# Altium schematic sheet main.SchDoc: Higgs Patch Antenna Array
size Letter; CompanyName: Signal Laboratories, Inc.; DrawnBy: J. Brinton; Engineer: J. Brinton; Address1: 3479 Edison Way; Address2: Menlo Park CA 94025; Address3: +1 (877) 778-8435; Address4: siglabs.com; Revision: 1; SheetNumber: 1; SheetTotal: 1
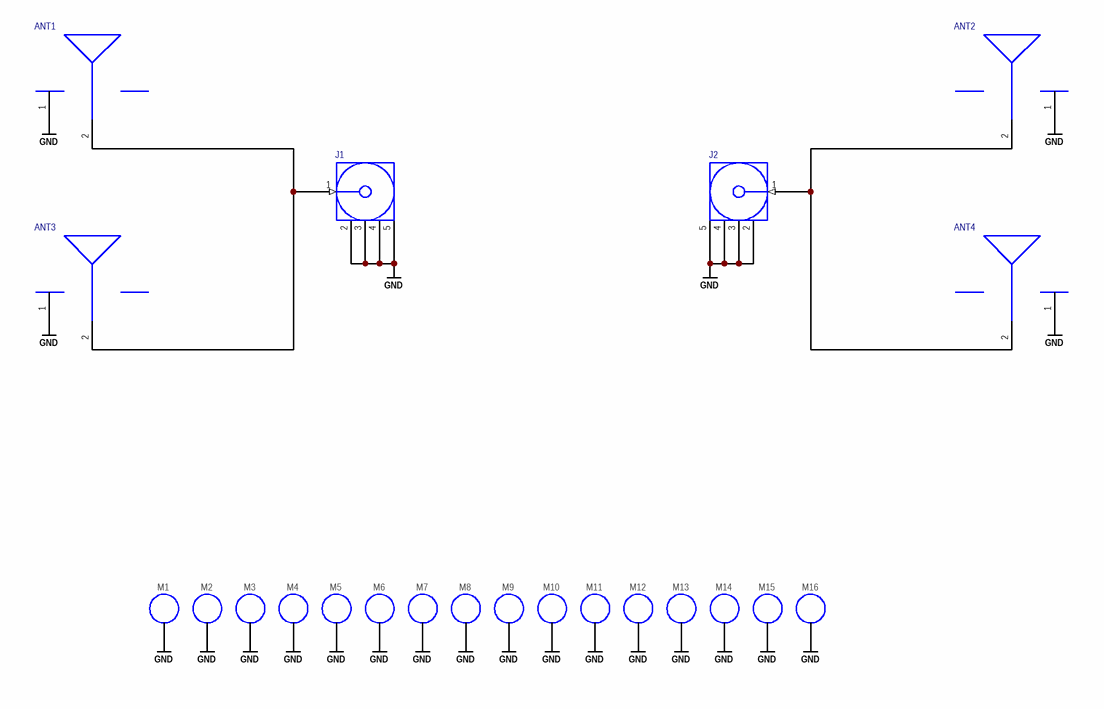
[diagram p0: main.SchDoc]

## Parts
ANT1  antenna_plane  [antenna_plane]  (value not drawn)
ANT2  antenna_plane  [antenna_plane]  (value not drawn)
ANT3  antenna_plane  [antenna_plane]  (value not drawn)
ANT4  antenna_plane  [antenna_plane]  (value not drawn)
J1  142146  [142146]  (value not drawn)
J2  142146  [142146]  (value not drawn)
M1  MOUNT  [MOUNTM3]  (value not drawn)  (no BOM)
M2  MOUNT  [MOUNTM3]  (value not drawn)  (no BOM)
M3  MOUNT  [MOUNTM3]  (value not drawn)  (no BOM)
M4  MOUNT  [MOUNTM3]  (value not drawn)  (no BOM)
M5  MOUNT  [MOUNTM3]  (value not drawn)  (no BOM)
M6  MOUNT  [MOUNTM3]  (value not drawn)  (no BOM)
M7  MOUNT  [MOUNTM3]  (value not drawn)  (no BOM)
M8  MOUNT  [MOUNTM3]  (value not drawn)  (no BOM)
M9  MOUNT  [MOUNTM3]  (value not drawn)  (no BOM)
M10  MOUNT  [MOUNTM3]  (value not drawn)  (no BOM)
M11  MOUNT  [MOUNTM3]  (value not drawn)  (no BOM)
M12  MOUNT  [MOUNTM3]  (value not drawn)  (no BOM)
M13  MOUNT  [MOUNTM3]  (value not drawn)  (no BOM)
M14  MOUNT  [MOUNTM3]  (value not drawn)  (no BOM)
M15  MOUNT  [MOUNTM3]  (value not drawn)  (no BOM)
M16  MOUNT  [MOUNTM3]  (value not drawn)  (no BOM)

## Nets
GND: ANT1.1 ANT2.1 ANT3.1 ANT4.1 J1.2(GND) J1.3(GND) J1.4(GND) J1.5(GND) J2.2(GND) J2.3(GND) J2.4(GND) J2.5(GND) M1.1(MNT) M2.1(MNT) M3.1(MNT) M4.1(MNT) M5.1(MNT) M6.1(MNT) M7.1(MNT) M8.1(MNT) M9.1(MNT) M10.1(MNT) M11.1(MNT) M12.1(MNT) M13.1(MNT) M14.1(MNT) M15.1(MNT) M16.1(MNT)
NetANT1_2: ANT1.2 ANT3.2 J1.1(Signal)
NetANT2_2: ANT2.2 ANT4.2 J2.1(Signal)

## Notes on the sheet
- Title
- Engineer
- Revision
- Drawn By
- Checked By
- Date
- Sheet
- of

## Library data of the parts
ANT1-ANT4 = antenna_plane: Manufacturer: Siglabs; Manufacturer P/N: antenna_plane
J1 J2 = COAX-F: Connector; RF Coaxial, SMB, Thru-Hole; 5 Position; Right-Angle; Manufacturer: Amphenol RF; Manufacturer P/N: 142146
M1-M16 = MOUNT: M3 Standard Fit Hole; Manufacturer: *; Manufacturer P/N: *